# Altium schematic sheet CurrentMeasure_InputProcessing.SchDoc
size A; SheetNumber: 4; SheetTotal: 5
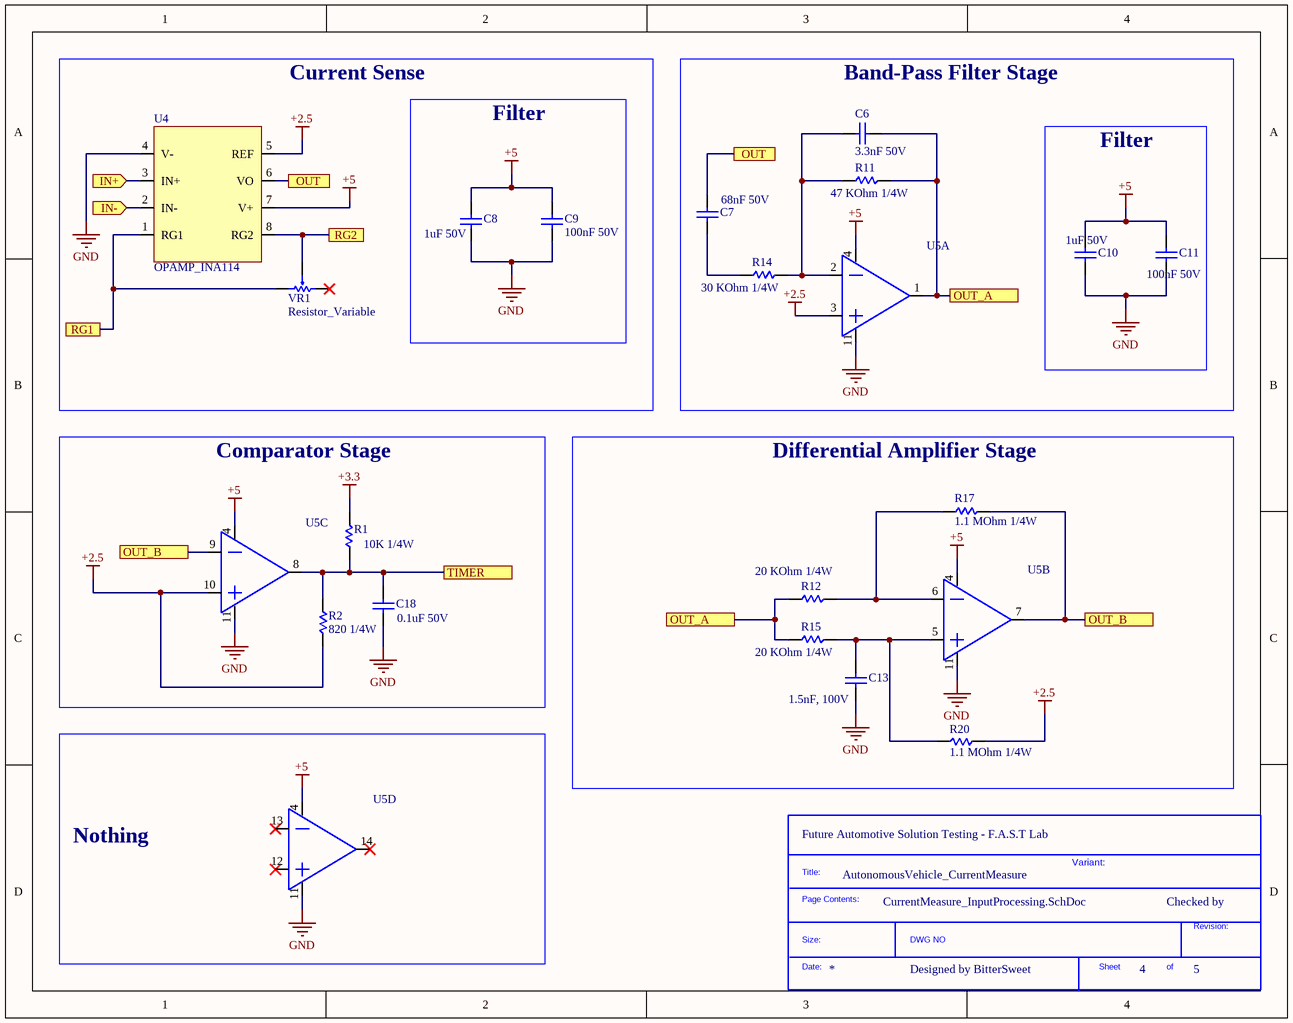
[diagram p0: CurrentMeasure_InputProcessing.SchDoc]

## Parts
*?  SDTitleBlock  (value not drawn)  (graphical)
C6  3.3nF 50V  [CAP_RADIAL_2.54]
C7  68nF 50V  [CAP_RADIAL_2.54]
C8  1uF 50V  [CAP_RADIAL_2.54]
C9  100nF 50V  [CAP_RADIAL_2.54]
C10  1uF 50V  [CAP_RADIAL_2.54]
C11  100nF 50V  [CAP_RADIAL_2.54]
C13  1.5nF, 100V  [Mica_CAP]
C18  0.1uF 50V  [CAP_RADIAL_2.54]
R1  10K 1/4W  [RESISTOR-1/4W]
R2  820 1/4W  [RESISTOR-1/4W]
R11  47 KOhm 1/4W  [RESISTOR-1/4W]
R12  20 KOhm 1/4W  [RESISTOR-1/4W]
R14  30 KOhm 1/4W  [RESISTOR-1/4W]
R15  20 KOhm 1/4W  [RESISTOR-1/4W]
R17  1.1 MOhm 1/4W  [RESISTOR-1/4W]
R20  1.1 MOhm 1/4W  [RESISTOR-1/4W]
U4  OPAMP_INA114  [INA114AP]
U5  IC_OPAMP_LM324N  [LM324_DIP14]  (value not drawn)  (parts A,B,C,D of 4)
VR1  Resistor_Variable  [RESISTOR_VARIABLE]

## Blocks framed on the sheet
Current Sense: U4 VR1
Band-Pass Filter Stage: C6 C7 R11 R14 U5
Filter: C8 C9
Filter: C10 C11
Comparator Stage: C18 R1 R2 U5
Differential Amplifier Stage: C13 R12 R15 R17 R20 U5
Nothing: U5

## Ports
IN+ (in), IN- (in), OUT, OUT_A, OUT_B, RG1, RG2, TIMER

## Nets
+2.5: R2.2 R20.1 U4.5(REF) U5.3(IN1+) U5.10(IN3+)
+3.3: R1.2
+5: C8.1 C9.1 C10.1 C11.1 U4.7(V+) U5.4(VCC)
GND: C8.2 C9.2 C10.2 C11.2 C13.2 C18.1 U4.4(V-) U5.11(GND)
IN+: U4.3(IN+) ; port IN+
IN-: U4.2(IN-) ; port IN-
OUT: C7.2 U4.6(VO) ; port OUT
OUT_A: C6.1 R11.2 R12.1 R15.1 U5.1(OUT1) ; port OUT_A
OUT_B: R17.2 U5.7(OUT2) U5.9(IN3-) ; port OUT_B
RG1: U4.1(RG1) VR1.1 ; port RG1
RG2: U4.8(RG2) VR1.2 ; port RG2
TIMER: C18.2 R1.1 R2.1 U5.8(OUT3) ; port TIMER
NetC6_2: C6.2 R11.1 R14.2 U5.2(IN1-)
NetC7_1: C7.1 R14.1
NetC13_1: C13.1 R15.2 R20.2 U5.5(IN2+)
NetR12_2: R12.2 R17.1 U5.6(IN2-)

Not connected (* = marked no-connect by the designer): U5 12(IN4+)* 13(IN4-)* 14(OUT4)*; VR1 3*

## Notes on the sheet
- (near *?) Future Automotive Solution Testing - F.A.S.T Lab
- AutonomousVehicle_CurrentMeasure
- Variant:
- Checked by
- Designed by BitterSweet
- (in symbol SDTitleBlock) Title:; Page Contents:; Revision:; Size:; DWG NO; Date:; Sheet; of

## Library data of the parts
C6 = Capacitor: Capacitor, 3.3nF 50V; URL: https://www.thegioiic.com/tu-gom-tron-3-3nf-50v
C7 = Capacitor: Capacitor, 68nF 50V; URL: https://www.thegioiic.com/tu-gom-tron-68nf-50v
C8 C10 = Capacitor: Capacitor 1uF 50V; URL: https://www.thegioiic.com/tu-gom-multilayer-1uf-50v
C9 C11 = Capacitor: Capacitor 100nF 50V; URL: https://www.thegioiic.com/tu-gom-tron-100nf-0-1uf-50v
C13 = Capacitor
C18 = Capacitor: Capacitor, 0.1uF 50V; URL: https://www.thegioiic.com/tu-gom-tron-100nf-0-1uf-50v
R1 = RESISTOR: Resistor 10 KOhm 1/4W; MP: NUCLEO-F401RE; Availability: Unavailable; Price: None; Package: None; Value: *; ComponentLink1Description: URL; ComponentLink1URL: https://www.thegioiic.com/dien-tro-10-kohm-1-4w-1-5-vong-mau
R2 = RESISTOR: Resistor 820 Ohm 1/4W; MP: NUCLEO-F401RE; Availability: Unavailable; Price: None; Package: None; Value: *; ComponentLink1Description: URL; ComponentLink1URL: https://www.thegioiic.com/dien-tro-820-ohm-1-4w-1-5-vong-mau
R11 R14 = RESISTOR: MP: NUCLEO-F401RE; Availability: Unavailable; Price: None; Package: None; Value: *
  R11: URL: https://www.thegioiic.com/dien-tro-47-kohm-1-4w-1-5-vong-mau
  R14: URL: https://www.thegioiic.com/dien-tro-30-kohm-1-4w-1-5-vong-mau
R12 R15 = RESISTOR: Resistor 20 KOhm 1/4W; MP: NUCLEO-F401RE; Availability: Unavailable; Price: None; Package: None; Value: *; ComponentLink1Description: URL; ComponentLink1URL: https://www.thegioiic.com/dien-tro-20-kohm-1-4w-1-5-vong-mau
R17 = RESISTOR: Resistor 1.1 MOhm 1/4W; MP: NUCLEO-F401RE; Availability: Unavailable; Price: None; Package: None; Value: *; ComponentLink1Description: URL; ComponentLink1URL: https://www.thegioiic.com/dien-tro-1-mohm-1-4w-1-5-vong-mau
R20 = RESISTOR: Resistor 1 MOhm 1/4W; MP: NUCLEO-F401RE; Availability: Unavailable; Price: None; Package: None; Value: *; ComponentLink1Description: URL; ComponentLink1URL: https://www.thegioiic.com/dien-tro-1-mohm-1-4w-1-5-vong-mau
U4 = OPAMP_INA114: INA114AP IC Instrumentation Amplifier 1MHZ, 8-DIP; URL: https://www.thegioiic.com/products?search=INA114
U5 = IC_OPAMP_LM324N: LM324N IC OPAMP General Purpose Amplifier 4 Circuit 1.2MHZ ,14-DIP; URL: https://www.thegioiic.com/lm324n-ic-opamp-general-purpose-amplifier-4-circuit-1-2mhz-14-dip
VR1 = Resistor_Variable: Variable Resister, 3 pins, 10 KOhm